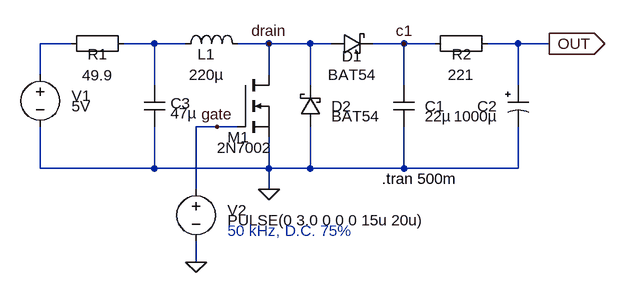
[diagram p0: schematic boost_cap_charger.asc]
boost_cap_charger.asc, the LTspice schematic file:
Version 4
SHEET 1 880 680
WIRE -32 112 -80 112
WIRE 96 112 48 112
WIRE 144 112 96 112
WIRE 272 112 224 112
WIRE 336 112 272 112
WIRE 368 112 336 112
WIRE 480 112 432 112
WIRE 528 112 480 112
WIRE 656 112 608 112
WIRE 704 112 656 112
WIRE -80 160 -80 112
WIRE 272 160 272 112
WIRE 96 176 96 112
WIRE 336 176 336 112
WIRE 480 176 480 112
WIRE 656 176 656 112
WIRE 192 240 160 240
WIRE 224 240 192 240
WIRE -80 304 -80 240
WIRE 96 304 96 240
WIRE 96 304 -80 304
WIRE 272 304 272 256
WIRE 272 304 96 304
WIRE 336 304 336 240
WIRE 336 304 272 304
WIRE 480 304 480 240
WIRE 480 304 336 304
WIRE 656 304 656 240
WIRE 656 304 480 304
WIRE 160 336 160 240
WIRE 272 336 272 304
WIRE 160 448 160 416
FLAG 272 336 0
FLAG 480 112 c1
FLAG 272 112 drain
FLAG 160 448 0
FLAG 704 112 OUT
IOPIN 704 112 Out
FLAG 192 240 gate
SYMBOL nmos 224 160 R0
WINDOW 0 -16 96 Left 2
WINDOW 3 -32 112 Left 2
SYMATTR InstName M1
SYMATTR Value 2N7002
SYMBOL ind 128 128 R270
WINDOW 0 -16 48 VTop 2
WINDOW 3 -16 48 VBottom 2
SYMATTR InstName L1
SYMATTR Value 220µ
SYMATTR SpiceLine Ipk=0.6 Rser=0.75 Rpar=144700 Cpar=3.235p mfg="Bourns, Inc." pn="SDE0805A-221K"
SYMBOL schottky 368 128 R270
WINDOW 0 -19 32 VTop 2
WINDOW 3 -16 32 VBottom 2
SYMATTR InstName D1
SYMATTR Value BAT54
SYMATTR Description Diode
SYMATTR Type diode
SYMBOL cap 464 176 R0
WINDOW 0 48 32 Left 2
WINDOW 3 48 48 Left 2
SYMATTR InstName C1
SYMATTR Value 22µ
SYMATTR SpiceLine V=25 Irms=0 Rser=0.003 Lser=0 mfg="TDK" pn="C575OX5RIE226M" type="X5R"
SYMBOL polcap 640 176 R0
WINDOW 0 -16 32 Right 2
WINDOW 3 -16 48 Right 2
SYMATTR InstName C2
SYMATTR Value 1000µ
SYMATTR Description Capacitor
SYMATTR Type cap
SYMATTR SpiceLine V=16 Irms=700m Rser=0.12 Lser=0 mfg="Nichicon" pn="UPR1C102MPH" type="Al electrolytic"
SYMBOL Misc\\EuropeanResistor 64 96 R90
WINDOW 0 48 56 VBottom 2
WINDOW 3 49 56 VTop 2
SYMATTR InstName R1
SYMATTR Value 49.9
SYMATTR SpiceLine tol=1 pwr=0.1
SYMBOL voltage -80 144 R0
WINDOW 0 48 48 Left 2
WINDOW 3 48 64 Left 2
WINDOW 123 0 0 Left 0
WINDOW 39 0 0 Left 0
SYMATTR InstName V1
SYMATTR Value 5V
SYMBOL Misc\\EuropeanResistor 624 96 R90
WINDOW 0 48 55 VBottom 2
WINDOW 3 48 56 VTop 2
SYMATTR InstName R2
SYMATTR Value 221
SYMATTR SpiceLine tol=1 pwr=0.1
SYMBOL voltage 160 320 R0
WINDOW 0 48 48 Left 2
WINDOW 3 48 64 Left 2
WINDOW 123 0 0 Left 0
WINDOW 39 0 0 Left 0
SYMATTR InstName V2
SYMATTR Value PULSE(0 3.0 0 0 0 15u 20u)
SYMBOL cap 80 176 R0
WINDOW 0 41 28 Left 2
WINDOW 3 41 43 Left 2
SYMATTR InstName C3
SYMATTR Value 47µ
SYMATTR SpiceLine V=16 Irms=11.7 Rser=0.00333036 Lser=0 mfg="KEMET" pn="C1210C476K4PAC" type="X5R"
SYMBOL schottky 352 240 R180
WINDOW 0 -16 32 Right 2
WINDOW 3 -16 16 Right 2
SYMATTR InstName D2
SYMATTR Value BAT54
SYMATTR Description Diode
SYMATTR Type diode
TEXT 446 320 Left 2 !.tran 500m
TEXT 208 400 Left 2 ;50 kHz, D.C. 75%

The netlist it stands for:
* boost_cap_charger.asc
M1 drain gate 0 0 2N7002
L1 N002 drain 220µ Ipk=0.6 Rser=0.75 Rpar=144700 Cpar=3.235p mfg="Bourns, Inc." pn="SDE0805A-221K"
D1 drain c1 BAT54
C1 c1 0 22µ V=25 Irms=0 Rser=0.003 Lser=0 mfg="TDK" pn="C575OX5RIE226M" type="X5R"
C2 OUT 0 1000µ V=16 Irms=700m Rser=0.12 Lser=0 mfg="Nichicon" pn="UPR1C102MPH" type="Al electrolytic"
R1 N002 N001 49.9 tol=1 pwr=0.1
V1 N001 0 5V
R2 OUT c1 221 tol=1 pwr=0.1
V2 gate 0 PULSE(0 3.0 0 0 0 15u 20u)
C3 N002 0 47µ V=16 Irms=11.7 Rser=0.00333036 Lser=0 mfg="KEMET" pn="C1210C476K4PAC" type="X5R"
D2 0 drain BAT54
.model D D
.lib standard.dio
.model NMOS NMOS
.model PMOS PMOS
.lib standard.mos
.tran 500m
* 50 kHz, D.C. 75%
.backanno
.end